# EAGLE schematic alarmclock (EAGLE 6.6.0)
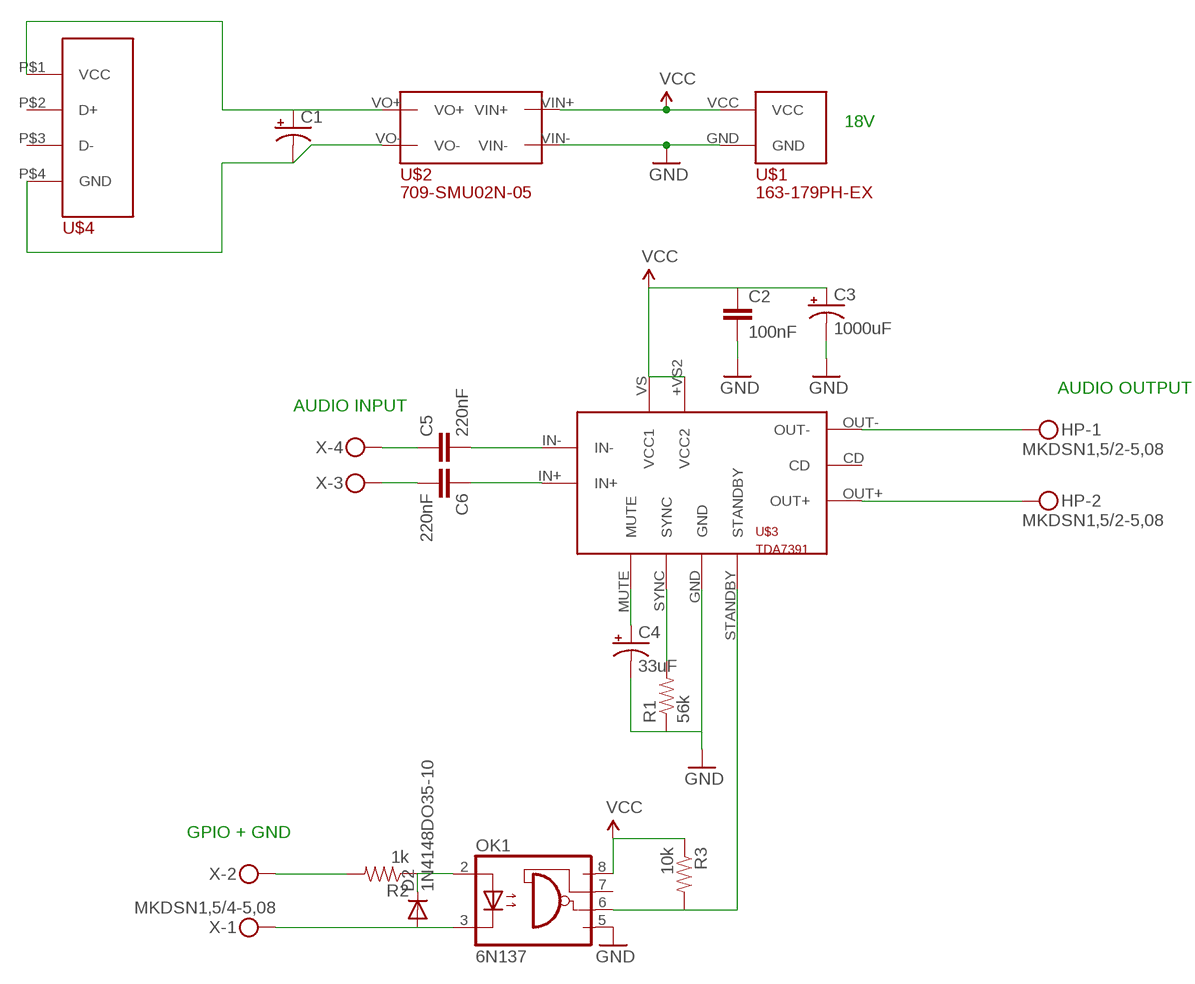
[diagram p0: schematic, sheet 1]

## Parts
C1  CAP_POLPTH3  [CPOL-RADIAL-1000UF-63V]
C2  100nF  CAPPTH1  [CAP-PTH-5MM]
C3  1000uF  CAP_POLPTH3  [CPOL-RADIAL-1000UF-63V]
C4  33uF  CAP_POLPTH4  [CPOL-RADIAL-1000UF-25V]
C5  220nF  CAPPTH1  [CAP-PTH-5MM]
C6  220nF  CAPPTH1  [CAP-PTH-5MM]
D2  1N4148DO35-10  [DO35-10]
HP  MKDSN1,5/2-5,08  [MKDSN1,5/2-5,08]
OK1  6N137  [DIL08]
R1  56k  RESISTORPTH-1/2W  [AXIAL-0.5]
R2  1k  RESISTORPTH-1/2W  [AXIAL-0.5]
R3  10k  RESISTORPTH-1/2W  [AXIAL-0.5]
U$1  163-179PH-EX  [163-179PH-EX_DIM]
U$2  709-SMU02N-05  [709-SMU02N-05_DIM]
U$3  TDA7391  [TDA7391_DIM]
U$4  USB_TYPEA_CONNECTOR  [USB_DIM]
X  MKDSN1,5/4-5,08  [MKDSN1,5/4-5,08]

## Nets
GND: C2.2 C3.2(-) C4.2(-) OK1.5(GND) R1.P$1 U$1.GND U$2.VIN- U$3.GND
N$1: R2.P$2 X.2
N$2: C4.1(+) U$3.MUTE
N$3: C1.1(+) U$2.VO+ U$4.P$1(VCC)
N$4: C1.2(-) U$2.VO- U$4.P$4(GND)
N$5: R1.P$2 U$3.SYNC
N$6: HP.1 U$3.OUT-
N$7: HP.2 U$3.OUT+
N$8: C5.1 X.4
N$9: C6.2 X.3
N$10: C5.2 U$3.IN-
N$11: C6.1 U$3.IN+
N$12: D2.C OK1.2(A) R2.P$1
N$13: D2.A OK1.3(C) X.1
N$14: OK1.6(VO) R3.P$2 U$3.STANDBY
VCC: C2.1 C3.1(+) OK1.8(VCC) R3.P$1 U$1.VCC U$2.VIN+ U$3.+VS2(VCC2) U$3.VS(VCC1)
Unconnected: OK1.7(VE) U$3.CD U$4.P$2(D+) U$4.P$3(D-)

## Notes on the sheet
- 18V
- AUDIO OUTPUT
- AUDIO INPUT
- GPIO + GND

## Library data of the parts
C1 C3 C4 = SparkFun-Passives:CAP_POL: Capacitor Polarized These are standard SMD and PTH capacitors. Normally 10uF, 47uF, and 100uF in electrolytic and tantalum varieties. Always verify the external diameter of the through hole cap, it varies with capacity, voltage, and manufacturer. The EIA devices should be standard.
C2 C5 C6 = SparkFun-Passives:CAP: Capacitor Standard 0603 ceramic capacitor, and 0.1" leaded capacitor.
D2 = diode:1N4148: DIODE high speed (Philips)
HP = con-phoenix-508:MKDSN1,5/2-5,08: MKDSN 1,5/ 2-5,08 Printklemme Nennstrom: 13,5 A Nennspannung: 250 V Rastermaß: 5,08 mm Polzahl: 2 Anschlussart: Schraubanschluss Montage: Löten Anschlussrichtung Leiter/Platine: 0 ° Artikelnummer: 1729128 Source: http://eshop.phoenixcontact.com .. 1729128.pdf
OK1 = optocoupler:6N137: MOTOROLA OPTO COUPLER; MPN: 6N137; OC_FARNELL: 1328376; OC_NEWARK: 52M1895
R1-R3 = SparkFun-Resistors:RESISTOR: Resistor Basic schematic elements and footprints for 0603, 1206, and PTH resistors.
U$1 = mouser:163-179PH-EX: BARREL POWER PLUG
U$2 = mouser:709-SMU02N-05
U$3 = mouser:TDA7391: ref Mouser: 511-TDA7391
U$4 = mouser:USB_TYPEA_CONNECTOR: ref Mouser: 710-61400416021
X = con-phoenix-508:MKDSN1,5/4-5,08: MKDSN 1,5/ 4-5,08 Printklemme Nennstrom: 13,5 A Nennspannung: 250 V Rastermaß: 5,08 mm Polzahl: 4 Anschlussart: Schraubanschluss Montage: Löten Anschlussrichtung Leiter/Platine: 0 ° Artikelnummer: 1729144 Source: http://eshop.phoenixcontact.com .. 1729144.pdf